# Altium schematic sheet 动感单车框图.SchDoc
size A4
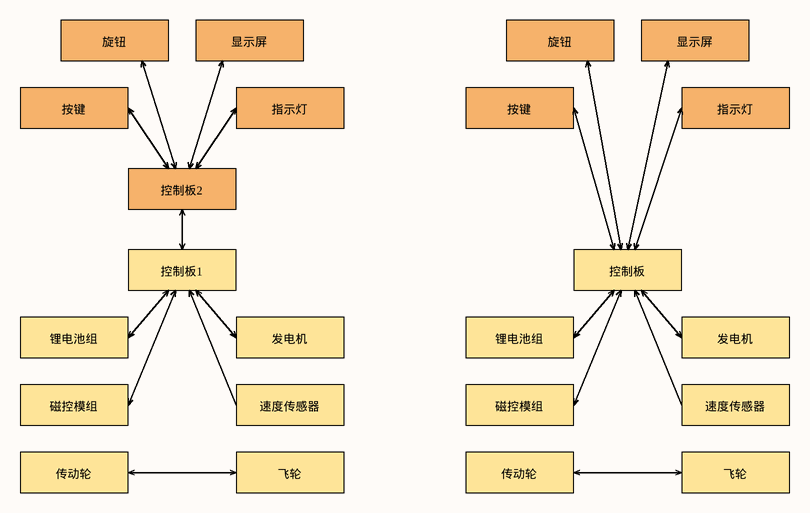
[diagram p0: 动感单车框图.SchDoc]

## Notes on the sheet
- 旋钮
- 显示屏
- 按键
- 指示灯
- 控制板2
- 控制板1
- 控制板
- 锂电池组
- 发电机
- 磁控模组
- 速度传感器
- 传动轮
- 飞轮